# EasyEDA schematic SCH_sensor-de-nível_2026-06-17.json
TITLE: Sheet_1; REV: 1.0; Date: 2026-06-10; Sheet: 1/1; Drawn By: luanahudler; Company: Your Company
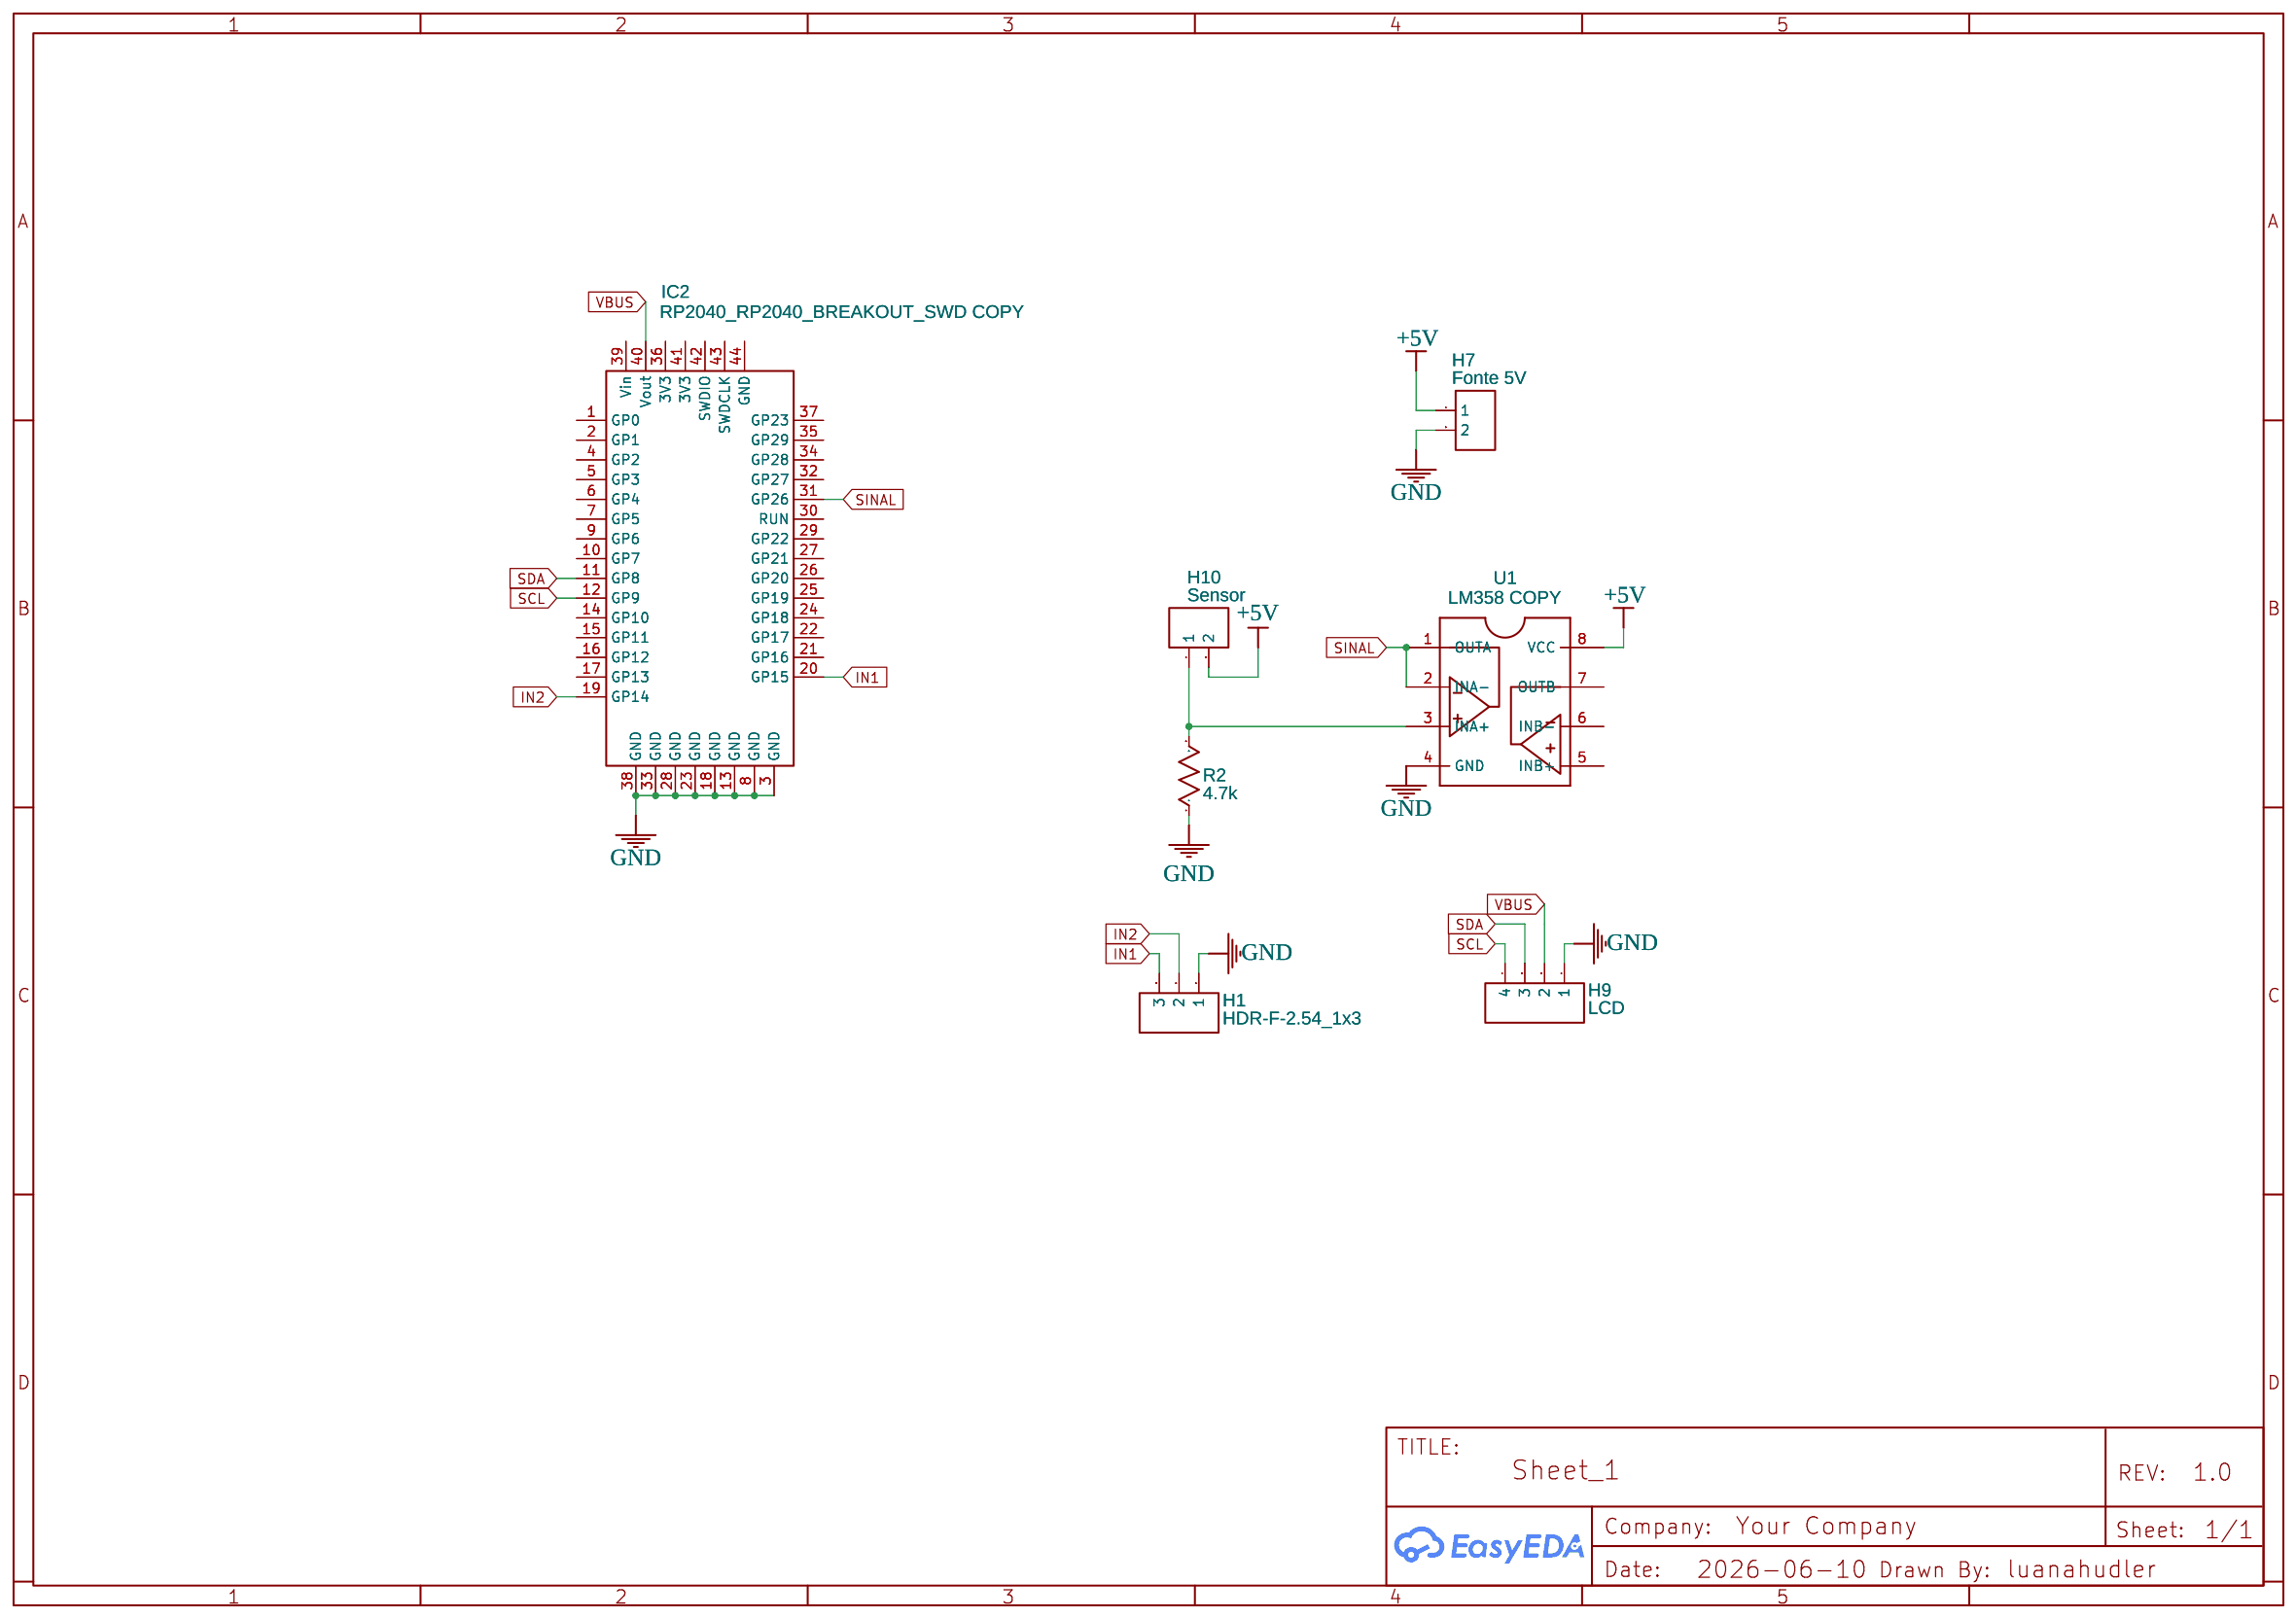
[diagram p0: schematic sheet]

## Parts
H1  HDR-F-2.54_1x3  [HDR-F-2.54_1X3]
H7  Fonte 5V  [HDR-F-2.54_1X2]
H9  LCD  [HDR-F-2.54_1X4]
H10  Sensor  [HDR-F-2.54_1X2]
IC2  RP2040_RP2040_BREAKOUT_SWD COPY  [RP2040:RP2040-BREAKOUT_SWD]
R2  4.7k  [R_AXIAL-0.3]
U1  LM358 COPY  [DIP-8-P2.54-L10.4-W10.4]

## Library data of the parts
H1 = HDR-F-2.54_1x3: Supplier Part: C146690; Supplier: LCSC; Contributor: LCEDA_Lib
H7 H10 = HDR-F-2.54_1x2: Supplier Part: C49661; Supplier: LCSC; Contributor: LCEDA_Lib
H9 = HDR-F-2.54_1x4: Supplier Part: C225501; Supplier: LCSC; Contributor: LCEDA_Lib
IC2 = RP2040_RP2040_BREAKOUT_SWD COPY: Symbol: rp2040_RP2040_breakout_swd; Device: rp2040_RP2040_breakout_swd; Add into BOM: yes; Convert to PCB: yes; Origin Footprint: RP2040-Breakout_swd; Contributor: rataweb
R2 = R_AXIAL-0.3_US: Contributor: LCEDA_Lib
U1 = LM358 COPY: Supplier Part: LM358; Manufacturer: LM358MX/NOPB; Manufacturer Part: TI; subpart_no: 2; image: http://image.lceda.cn/szlcsc/C16416.jpg; JLCPCB Part Class: Extended Part; Contributor: LHKhoo

## Nets
+5V: H7.1 H10.2 U1.8(VCC)
GND: H1.1 H7.2 H9.1 IC2.3(GND) IC2.8(GND) IC2.13(GND) IC2.18(GND) IC2.23(GND) IC2.28(GND) IC2.33(GND) IC2.38(GND) R2.1 U1.4(GND)
VBUS: H9.2 IC2.40(Vout)
IN1: H1.3 IC2.20(GP15)
IN2: H1.2 IC2.19(GP14)
SCL: H9.4 IC2.12(GP9)
SDA: H9.3 IC2.11(GP8)
SINAL: IC2.31(GP26) U1.1(OUTA) U1.2(INA-)
Net-(H10-1): H10.1 R2.2 U1.3(INA+)

Not connected (* = marked no-connect by the designer): IC2 1(GP0) 2(GP1) 4(GP2) 5(GP3) 6(GP4) 7(GP5) 9(GP6) 10(GP7) 14(GP10) 15(GP11) 16(GP12) 17(GP13) 21(GP16) 22(GP17) 24(GP18) 25(GP19) 26(GP20) 27(GP21) 29(GP22) 30(RUN) 32(GP27) 34(GP28) 35(GP29) 36(3V3) 37(GP23) 39(Vin) 41(3V3) 42(SWDIO) 43(SWDCLK) 44(GND); U1 5(INB+) 6(INB-) 7(OUTB)
